# Altium schematic sheet Sheet8.SchDoc
size A4
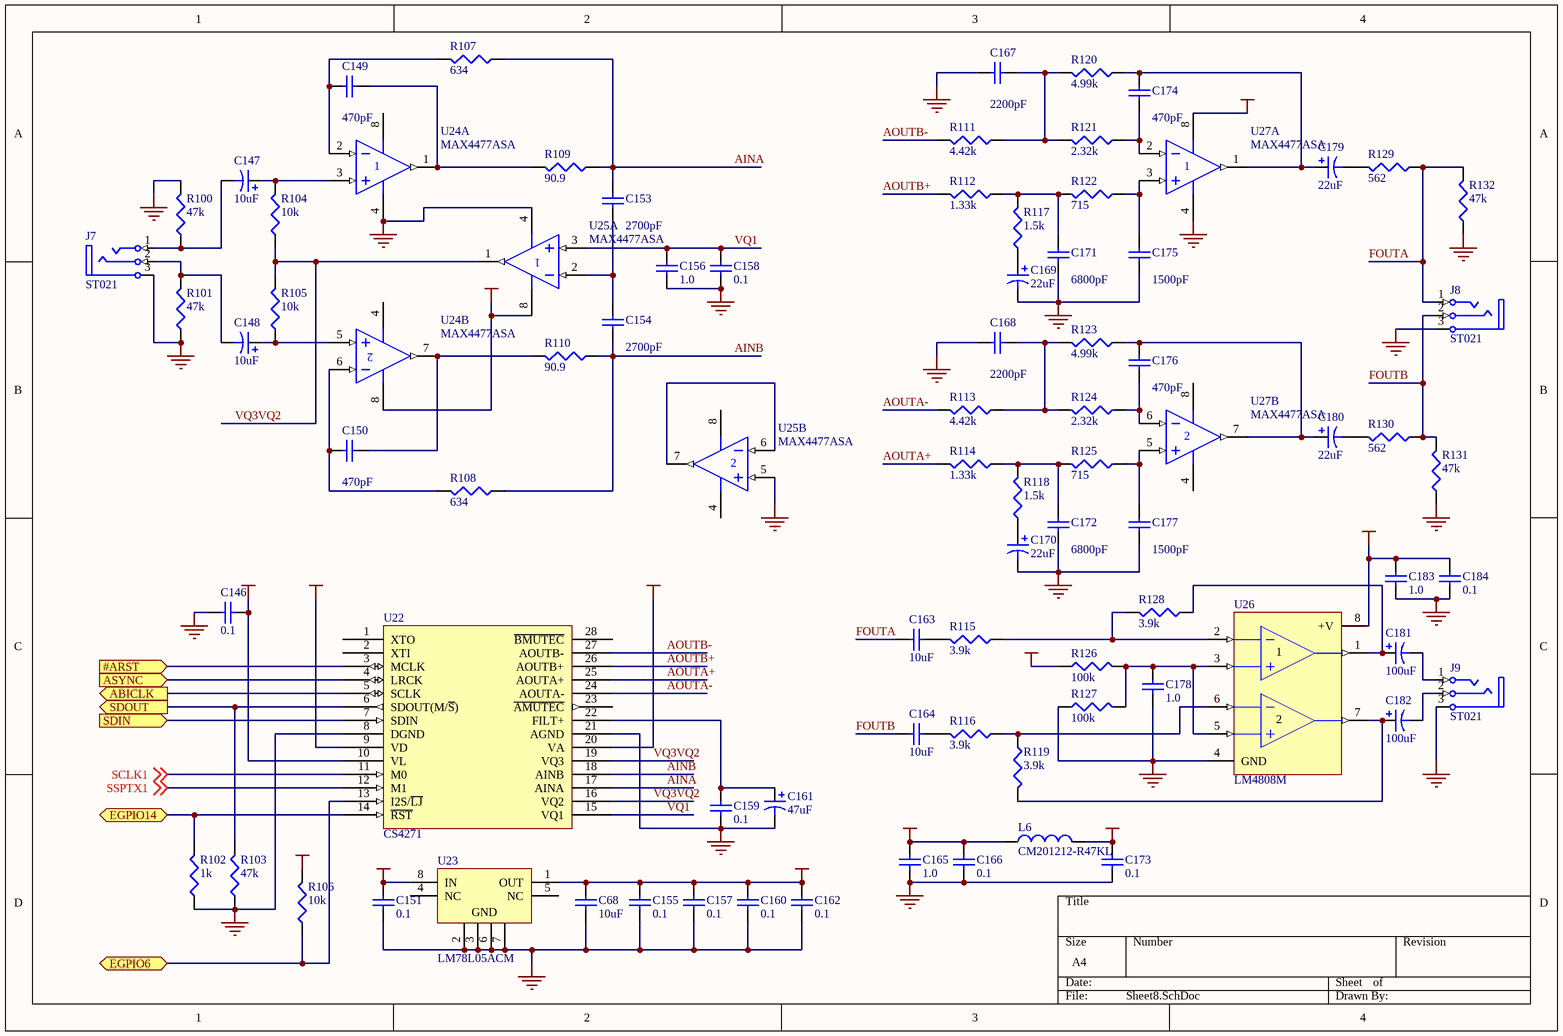
[diagram p0: Sheet8.SchDoc]

## Parts
C68  10uF  [1206]
C146  0.1  [0603]
C147  10uF  [CAPPR1.5-4x5]
C148  10uF  [CAPPR1.5-4x5]
C149  470pF  [0603]
C150  470pF  [0603]
C151  0.1  [0603]
C153  2700pF  [0603]
C154  2700pF  [0603]
C155  0.1  [0603]
C156  1.0  [0603]
C157  0.1  [0603]
C158  0.1  [0603]
C159  0.1  [0603]
C160  0.1  [0603]
C161  47uF  [CAPPR1.5-4x5]
C162  0.1  [0603]
C163  10uF  [1206]
C164  10uF  [1206]
C165  1.0  [0603]
C166  0.1  [0603]
C167  2200pF  [0603]
C168  2200pF  [0603]
C169  22uF  [CAPPR1.5-4x5]
C170  22uF  [CAPPR1.5-4x5]
C171  6800pF  [0603]
C172  6800pF  [0603]
C173  0.1  [0603]
C174  470pF  [0603]
C175  1500pF  [0603]
C176  470pF  [0603]
C177  1500pF  [0603]
C178  1.0  [0603]
C179  22uF  [CAPPR1.5-4x5]
C180  22uF  [CAPPR1.5-4x5]
C181  100uF  [CAPPR1.5-4x5]
C182  100uF  [CAPPR1.5-4x5]
C183  1.0  [0603]
C184  0.1  [0603]
J7  ST021  [ST023]
J8  ST021  [ST023]
J9  ST021  [ST023]
L6  CM201212-R47KL  [INDC2012-0805]
R100  47k  [CR1608-0603]
R101  47k  [CR1608-0603]
R102  1k  [CR1608-0603]
R103  47k  [CR1608-0603]
R104  10k  [CR1608-0603]
R105  10k  [CR1608-0603]
R106  10k  [CR1608-0603]
R107  634  [CR1608-0603]
R108  634  [CR1608-0603]
R109  90.9  [CR1608-0603]
R110  90.9  [CR1608-0603]
R111  4.42k  [CR1608-0603]
R112  1.33k  [CR1608-0603]
R113  4.42k  [CR1608-0603]
R114  1.33k  [CR1608-0603]
R115  3.9k  [CR1608-0603]
R116  3.9k  [CR1608-0603]
R117  1.5k  [CR1608-0603]
R118  1.5k  [CR1608-0603]
R119  3.9k  [CR1608-0603]
R120  4.99k  [CR1608-0603]
R121  2.32k  [CR1608-0603]
R122  715  [CR1608-0603]
R123  4.99k  [CR1608-0603]
R124  2.32k  [CR1608-0603]
R125  715  [CR1608-0603]
R126  100k  [CR1608-0603]
R127  100k  [CR1608-0603]
R128  3.9k  [CR1608-0603]
R129  562  [CR1608-0603]
R130  562  [CR1608-0603]
R131  47k  [CR1608-0603]
R132  47k  [CR1608-0603]
U22  CS4271  [TSOP28]
U23  LM78L05ACM  [M08A]
U24  MAX4477ASA  [NSO8]  (parts A,B of 2)
U25  MAX4477ASA  [NSO8]  (parts A,B of 2)
U26  LM4808M  [M08A]
U27  MAX4477ASA  [NSO8]  (parts A,B of 2)

## Ports
#ARST (in), ABICLK (out), ASYNC (in), EGPIO6 (bidir), EGPIO14 (bidir), SDIN (in), SDOUT (out)

## Nets
GND: C68.1 C146.1 C151.2 C155.2 C156.1 C157.2 C158.1 C159.2 C160.2 C161.2 C162.2 C165.1 C166.2 C167.2 C168.2 C169.2 C170.2 C171.1 C172.1 C173.2 C175.1 C177.1 C178.1 C183.1 C184.2 J7.3(S) J8.3(S) J9.3(S) R100.2 R101.1 R102.1 R103.1 R127.1 R131.1 R132.1 U22.8(DGND) U22.21(AGND) U23.2(GND) U23.3(GND) U23.6(GND) U23.7(GND) U24.4(VEE) U25.4(VEE) U25.5(IN+) U26.4(GND) U27.4(VEE)
VCC5V0: C173.1 L6.2
VCC12: C151.1 U23.8(IN)
VCC_5V0_AD: C68.2 C155.1 C157.1 C160.1 C162.1 C183.2 C184.1 R126.1 U22.20(VA) U23.1(OUT) U24.8(VCC) U25.8(VCC) U26.8(+V) U27.8(VCC)
VCC_5V0_I2S: C165.2 C166.1 L6.1 U22.9(VD)
VCCIO: C146.2 R106.2 U22.10(VL)
#ARST: U22.3(MCLK) ; port #ARST
ABICLK: U22.5(SCLK) ; port ABICLK
AINA: C153.2 R107.1 R109.1 U22.17(AINA)
AINB: C154.1 R108.1 R110.1 U22.18(AINB)
AOUTA+: R114.2 U22.25(AOUTA+)
AOUTA-: R113.2 U22.24(AOUTA-)
AOUTB+: R112.2 U22.26(AOUTB+)
AOUTB-: R111.2 U22.27(AOUTB-)
ASYNC: U22.4(LRCK) ; port ASYNC
EGPIO6: R106.1 U22.13(I2S/~{LJ}) ; port EGPIO6
EGPIO14: R102.2 U22.14(~{RST}) ; port EGPIO14
FOUTA: C163.2 J8.1(T) R129.1 R132.2
FOUTB: C164.2 J8.2(R) R130.1 R131.2
SCLK1: U22.11(M0) ; off-sheet SCLK1
SDIN: U22.7(SDIN) ; port SDIN
SDOUT: R103.2 U22.6(SDOUT(M/~{S})) ; port SDOUT
SSPTX1: U22.12(M1) ; off-sheet SSPTX1
VQ1: C156.2 C158.2 U22.15(VQ1) U25.3(IN+)
VQ3VQ2: R104.1 R105.2 U22.16(VQ2) U22.19(VQ3) U25.1(OUT)
NetC147_1: C147.1 R104.2 U24.3(IN+)
NetC147_2: C147.2 J7.1(T) R100.1
NetC148_1: C148.1 R105.1 U24.5(IN+)
NetC148_2: C148.2 J7.2(R) R101.2
NetC149_1: C149.1 R107.2 U24.2(IN-)
NetC149_2: C149.2 R109.2 U24.1(OUT)
NetC150_1: C150.1 R108.2 U24.6(IN-)
NetC150_2: C150.2 R110.2 U24.7(OUT)
NetC153_1: C153.1 C154.2 U25.2(IN-)
NetC159_1: C159.1 C161.1 U22.22(FILT+)
NetC163_1: C163.1 R115.2
NetC164_1: C164.1 R116.2
NetC167_1: C167.1 R111.1 R120.2 R121.2
NetC168_1: C168.1 R113.1 R123.2 R124.2
NetC169_1: C169.1 R117.1
NetC170_1: C170.1 R118.1
NetC171_2: C171.2 R112.1 R117.2 R122.2
NetC172_2: C172.2 R114.1 R118.2 R125.2
NetC174_1: C174.1 R121.1 U27.2(IN-)
NetC174_2: C174.2 C179.1 R120.1 U27.1(OUT)
NetC175_2: C175.2 R122.1 U27.3(IN+)
NetC176_1: C176.1 R124.1 U27.6(IN-)
NetC176_2: C176.2 C180.1 R123.1 U27.7(OUT)
NetC177_2: C177.2 R125.1 U27.5(IN+)
NetC178_2: C178.2 R126.2 R127.2 U26.3(IN+) U26.5(IN+)
NetC179_2: C179.2 R129.2
NetC180_2: C180.2 R130.2
NetC181_1: C181.1 R128.1 U26.1(OUT)
NetC181_2: C181.2 J9.1(T)
NetC182_1: C182.1 R119.2 U26.7(OUT)
NetC182_2: C182.2 J9.2(R)
NetR115_1: R115.1 R128.2 U26.2(IN-)
NetR116_1: R116.1 R119.1 U26.6(IN-)
NetU25_6: U25.6(IN-) U25.7(OUT)

Not connected (* = marked no-connect by the designer): U22 1(XTO) 2(XTI) 23(~{AMUTEC}) 28(~{BMUTEC}); U23 4(NC) 5(NC)

## Library data of the parts
C68 C163 C164 = C1206: Ceramic Chip Capacitor - Standard; Published: 17-Jul-2002; LatestRevisionDate: 19-Mar-2004; LatestRevisionNote: Silkscreen size reduced.; DatasheetDocument: Mar-2001; PackageDocument: Mar-2001; PackageReference: 1206; Publisher: Altium Limited; Code_JEITA: 1206; Code_IPC: 3216 [1206]; ComponentLink1Description: Manufacturer Link; ComponentLink1URL: http://www.kemet.com/; ComponentLink2Description: Datasheet; ComponentLink2URL: http://www.kemet.com/kemet/web/homepage/kechome.nsf/vapubfilesname/F3102TA.pdf/$file/F3102TA.pdf; Value: 10uF
C146 C149-C151 C153-C160 C162 C165-C168 C171-C178 C183 C184 = C0603: Ceramic Chip Capacitor - Standard; Note: Footprint corresponds to dimensions for bulk cassette packaging. This case size has tightened tolerances.; Published: 17-Jul-2002; LatestRevisionDate: 19-Mar-2004; LatestRevisionNote: Silkscreen size reduced.; DatasheetDocument: Mar-2001; PackageDocument: Mar-2001; PackageReference: 0603; Publisher: Altium Limited; Code_JEITA: 0603; Code_IPC: 1608 [0603]; ComponentLink1Description: Manufacturer Link; ComponentLink1URL: http://www.kemet.com/; ComponentLink2Description: Datasheet; ComponentLink2URL: http://www.kemet.com/kemet/web/homepage/kechome.nsf/vapubfilesname/F3102TA.pdf/$file/F3102TA.pdf
  C146 C151 C155 C157-C160 C162 C166 C173 C184: Value: 0.1
  C149 C150 C174 C176: Value: 470pF
  C153 C154: Value: 2700pF
  C156 C165 C178 C183: Value: 1.0
  C167 C168: Value: 2200pF
  C171 C172: Value: 6800pF
  C175 C177: Value: 1500pF
C147 C148 C161 C169 C170 C179-C182 = Cap Pol1: Polarized Capacitor (Radial); Published: 8-Jun-2000; LatestRevisionDate: 17-Jul-2002; LatestRevisionNote: Re-released for DXP Platform.; Publisher: Altium Limited
J7-J9 = PhoneJack: 3.5" jack
L6 = Inductor: Published: 8-Jun-2000; Revision: July-2002: Re-released for DXP Platform.; Publisher: Altium Limited; Value: CM201212-R47KL
R100-R132 = Res3: Resistor; Published: 8-Jun-2000; Revision: July-2002: Re-released for DXP Platform.; Publisher: Altium Limited
  R100 R101 R103 R131 R132: Value: 47k
  R102: Value: 1k
  R104-R106: Value: 10k
  R107 R108: Value: 634
  R109 R110: Value: 90.9
  R111 R113: Value: 4.42k
  R112 R114: Value: 1.33k
  R115 R116 R119 R128: Value: 3.9k
  R117 R118: Value: 1.5k
  R120 R123: Value: 4.99k
  R121 R124: Value: 2.32k
  R122 R125: Value: 715
  R126 R127: Value: 100k
  R129 R130: Value: 562
U22 = CS4271: 24-Bit, 192 kHz Stereo Audio CODEC
U23 = LM78L05ACM: 3-Terminal Positive Regulator; Published: 15-Apr-2002; LatestRevisionDate: 6-Jun-2005; LatestRevisionNote: Stylized 3D Model Added.; DatasheetDocument: Sep-1999; PackageDocument: Sep-1997; PackageReference: M08A; Publisher: Altium Limited; Code_JEDEC: MS-012-AA; Code_IPC: SO8; ComponentLink1Description: Manufacturer Link; ComponentLink1URL: http://www.national.com/
U24 U25 U27 = MAX4242ESA: Dual, +1.8V/10µA, SOT23, Beyond-the-Rails Op Amp; Published: 23-Sep-2002; LatestRevisionDate: 6-Jun-2005; LatestRevisionNote: Stylized 3D Model Added.; DatasheetDocument: Rev 0; 3/98; PackageReference: NSO8; Publisher: Altium Limited; Code_JEDEC: MS-012-AA; Code_IPC: SO8; ComponentLink1Description: Manufacturer Link; ComponentLink1URL: http://www.maxim-ic.com/; ComponentLink2Description: Datasheet; ComponentLink2URL: http://pdfserv.maxim-ic.com/en/ds/MAX4240-MAX4244.pdf
U26 = LM4808M: Dual 105 mW Headphone Amplifier